# EAGLE schematic Tesseract_SERVO (EAGLE 7.7.0)
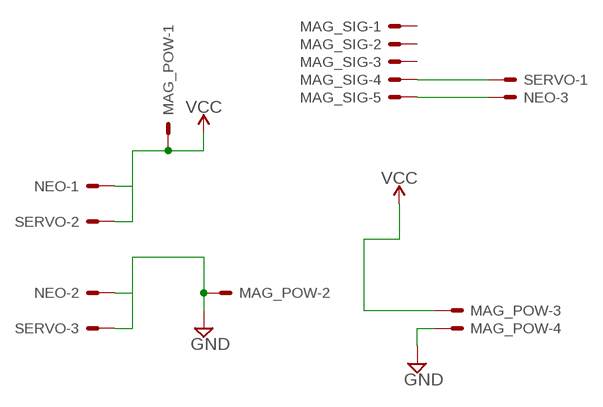
[diagram p0: schematic, sheet 1]

## Parts
MAG_POW  JST-XH-04-PIN-LONG-PAD  [JST-XH-04-PACKAGE-LONG-PAD]
MAG_SIG  JST-XH-05-PIN-LONG-PAD  [JST-XH-05-PACKAGE-LONG-PAD]
NEO  JST-XH-03-PIN-LONG-PAD  [JST-XH-03-PACKAGE-LONG-PAD]
SERVO  JST-XH-03-PIN-LONG-PAD  [JST-XH-03-PACKAGE-LONG-PAD]

## Nets
5V_GND: MAG_POW.2 NEO.2 SERVO.3 ; supply symbol labelled GND
5V_VCC: MAG_POW.1 NEO.1 SERVO.2 ; supply symbol labelled VCC
12V_GND: MAG_POW.4 ; supply symbol labelled GND
12V_VCC: MAG_POW.3 ; supply symbol labelled VCC
PIN6: MAG_SIG.4 SERVO.1
PIN7: MAG_SIG.5 NEO.3
Unconnected: MAG_SIG.1 MAG_SIG.2 MAG_SIG.3

## Library data of the parts
MAG_POW = Rembrandt Electronics - JST XH Connectors v1-0:JST-XH-04-PIN: JST XH Connector 2 Pin Wire to board connector. Pitch: 2,54 mm, (0.100") Number of pins: 4 Created by Rembrandt Electronics www.rembrandtelectronics.com
MAG_SIG = Rembrandt Electronics - JST XH Connectors v1-0:JST-XH-05-PIN: JST XH Connector 2 Pin Wire to board connector. Pitch: 2,54 mm, (0.100") Number of pins: 5 Created by Rembrandt Electronics www.rembrandtelectronics.com
NEO SERVO = Rembrandt Electronics - JST XH Connectors v1-0:JST-XH-03-PIN: JST XH Connector 2 Pin Wire to board connector. Pitch: 2,54 mm, (0.100") Number of pins: 3 Created by Rembrandt Electronics www.rembrandtelectronics.com